# EAGLE schematic hi_min_subsystem (EAGLE 9.6.1)
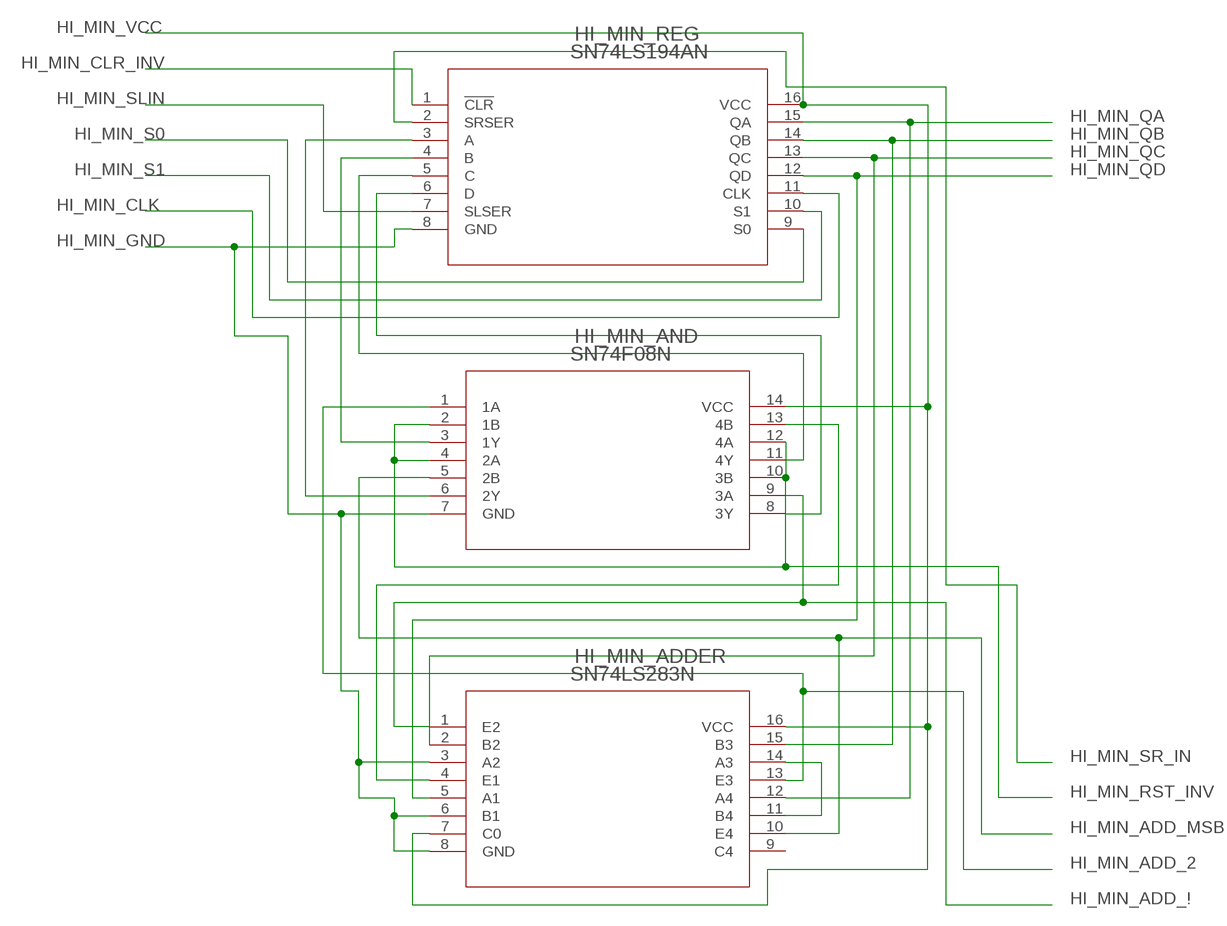
[diagram p0: schematic, sheet 1]

## Parts
HI_MIN_ADDER  SN74LS283N  [N16]
HI_MIN_AND  SN74F08N  [N14]
HI_MIN_REG  SN74LS194AN  [N16]

## Nets
HI_MIN_ADD_2: HI_MIN_ADDER.13(E3) HI_MIN_AND.1(1A)
HI_MIN_ADD_!: HI_MIN_ADDER.1(E2) HI_MIN_AND.9(3A)
HI_MIN_ADD_MSB: HI_MIN_ADDER.10(E4) HI_MIN_AND.5(2B)
HI_MIN_CLK: HI_MIN_REG.11(CLK)
HI_MIN_CLR_INV: HI_MIN_REG.1(!CLR)
HI_MIN_GND: HI_MIN_ADDER.3(A2) HI_MIN_ADDER.6(B1) HI_MIN_ADDER.8(GND) HI_MIN_AND.7(GND) HI_MIN_REG.8(GND)
HI_MIN_QA: HI_MIN_ADDER.12(A4) HI_MIN_REG.15(QA)
HI_MIN_QB: HI_MIN_ADDER.15(B3) HI_MIN_REG.14(QB)
HI_MIN_QC: HI_MIN_ADDER.2(B2) HI_MIN_REG.13(QC)
HI_MIN_QD: HI_MIN_ADDER.5(A1) HI_MIN_REG.12(QD)
HI_MIN_RST_INV: HI_MIN_AND.2(1B) HI_MIN_AND.4(2A) HI_MIN_AND.10(3B) HI_MIN_AND.12(4A)
HI_MIN_S0: HI_MIN_REG.9(S0)
HI_MIN_S1: HI_MIN_REG.10(S1)
HI_MIN_SLIN: HI_MIN_REG.7(SLSER)
HI_MIN_SR_IN: HI_MIN_REG.2(SRSER)
HI_MIN_VCC: HI_MIN_ADDER.7(C0) HI_MIN_ADDER.16(VCC) HI_MIN_AND.14(VCC) HI_MIN_REG.16(VCC)
N$6: HI_MIN_AND.6(2Y) HI_MIN_REG.3(A)
N$7: HI_MIN_AND.3(1Y) HI_MIN_REG.4(B)
N$8: HI_MIN_AND.11(4Y) HI_MIN_REG.5(C)
N$9: HI_MIN_AND.8(3Y) HI_MIN_REG.6(D)
N$10: HI_MIN_ADDER.4(E1) HI_MIN_AND.13(4B)
N$11: HI_MIN_ADDER.11(B4) HI_MIN_ADDER.14(A3)
Unconnected: HI_MIN_ADDER.9(C4)

## Library data of the parts
HI_MIN_ADDER = sn74ls283n:SN74LS283N: 4-Bit Full Adder w/ Fast Carry; DATASHEET_URL: http://www.ti.com/lit/gpn/SN74LS283; DESCRIPTION: 4-Bit Binary Full Adders With Fast Carry; FAMILY_NAME: ADDER; GENERIC_PART_NUMBER: SN74LS283; INDUSTRY_STD_PKG_TYPE: PDIP; MANUFACTURER: Texas Instruments; PACKAGE_DESIGNATOR: N; PIN_COUNT: 16
HI_MIN_AND = sn74f08n:SN74F08N: Quad 2-In Positive AND; DATASHEET_URL: http://www.ti.com/lit/gpn/SN74F08; DESCRIPTION: Quadruple 2-Input Positive-AND Gate; FAMILY_NAME: AND GATE; GENERIC_PART_NUMBER: SN74F08; INDUSTRY_STD_PKG_TYPE: PDIP; MANUFACTURER: Texas Instruments; PACKAGE_DESIGNATOR: N; PIN_COUNT: 14
HI_MIN_REG = sn74ls194an:SN74LS194AN: 4-Bit BiDir. Universal Shift Register; DATASHEET_URL: http://www.ti.com/lit/gpn/SN74LS194A; DESCRIPTION: Bidirectional universal shift registers; FAMILY_NAME: SHIFT REGISTER; GENERIC_PART_NUMBER: SN74LS194A; INDUSTRY_STD_PKG_TYPE: PDIP; MANUFACTURER: Texas Instruments; PACKAGE_DESIGNATOR: N; PIN_COUNT: 16